# EasyEDA schematic SCH_Pedal ECU_2023-06-15.json
TITLE: Sheet_1; REV: 1.0; Date: 2023-06-01; Sheet: 1/1; Company: Your Company
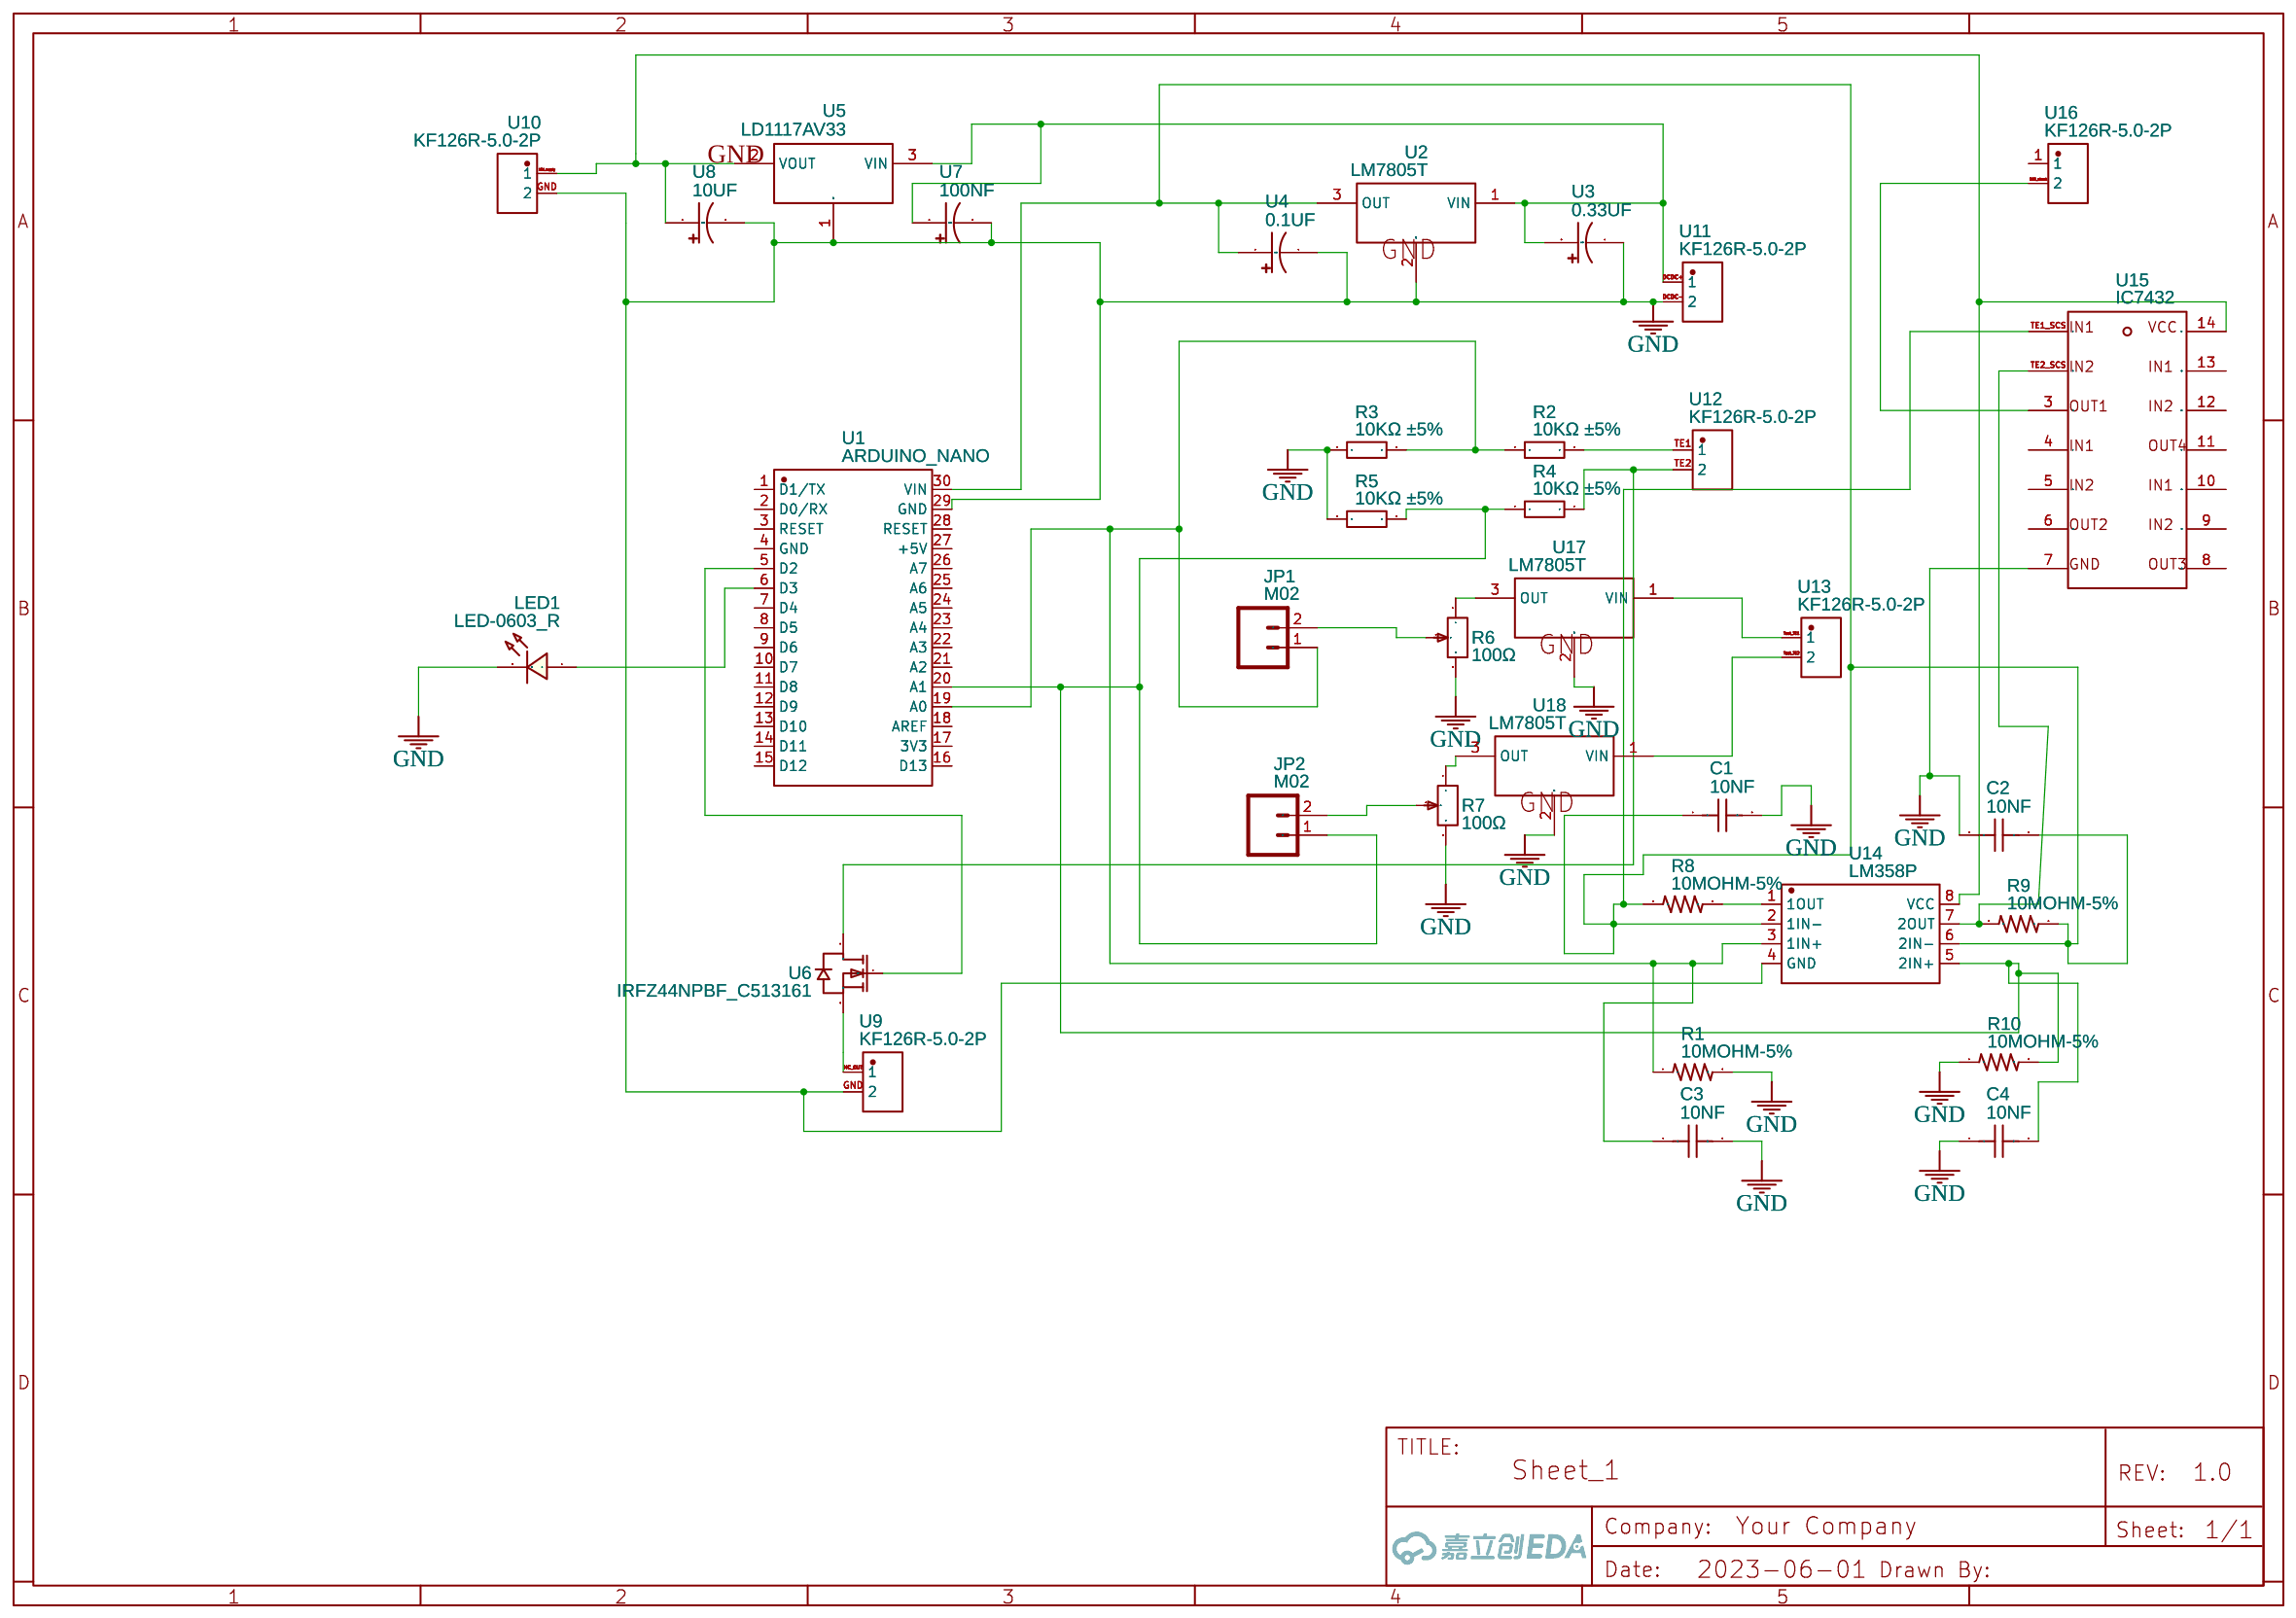
[diagram p0: schematic sheet]

## Parts
C1  10NF  [CAP-TH_L10.0-W4.5-P7.50-D0.6]
C2  10NF  [CAP-TH_L10.0-W4.5-P7.50-D0.6]
C3  10NF  [CAP-TH_L10.0-W4.5-P7.50-D0.6]
C4  10NF  [CAP-TH_L10.0-W4.5-P7.50-D0.6]
JP1  M02  [SCREWTERMINAL-3.5MM-2-NS]
JP2  M02  [SCREWTERMINAL-3.5MM-2-NS]
LED1  LED-0603_R  [LED0603_RED]
R1  10MOHM-5%  [0603]
R2  10KΩ ±5%  [RESISTANCE 10K]
R3  10KΩ ±5%  [RESISTANCE 10K]
R4  10KΩ ±5%  [RESISTANCE 10K]
R5  10KΩ ±5%  [RESISTANCE 10K]
R6  100Ω  [RES-ADJ-TH_3296W]
R7  100Ω  [RES-ADJ-TH_3296W]
R8  10MOHM-5%  [0603]
R9  10MOHM-5%  [0603]
R10  10MOHM-5%  [0603]
U1  ARDUINO_NANO  [COMM-TH_ARDUINO_NANO]
U2  LM7805T  [TO-220-3_L10.0-W4.5-P2.54-L]
U3  0.33UF  [CAP-SMD_L3.4-W2.9-RD]
U4  0.1UF  [CAP-SMD_L3.4-W2.9-RD]
U5  LD1117AV33  [TO-220-3_L10.0-W4.5-P2.54-L]
U6  IRFZ44NPBF_C513161  [TO-220-3_L10.0-W4.5-P2.54-L]
U7  100NF  [CAP-SMD_L3.4-W2.9-RD]
U8  10UF  [CAP-SMD_L3.4-W2.9-RD]
U9  KF126R-5.0-2P  [CONN-TH_P5.00_KF126R-5.0-2P]
U10  KF126R-5.0-2P  [CONN-TH_P5.00_KF126R-5.0-2P]
U11  KF126R-5.0-2P  [CONN-TH_P5.00_KF126R-5.0-2P]
U12  KF126R-5.0-2P  [CONN-TH_P5.00_KF126R-5.0-2P]
U13  KF126R-5.0-2P  [CONN-TH_P5.00_KF126R-5.0-2P]
U14  LM358P  [DIP-8_L9.4-W6.4-P2.54-LS9.1-BL]
U15  IC7432  [IC7432]
U16  KF126R-5.0-2P  [CONN-TH_P5.00_KF126R-5.0-2P]
U17  LM7805T  [TO-220-3_L10.0-W4.5-P2.54-L]
U18  LM7805T  [TO-220-3_L10.0-W4.5-P2.54-L]

## Library data of the parts
C1 C3 C4 = 250V 0.1UF 5% CBBCapacitor: Supplier: LCSC; Manufacturer: ReliaPro; Supplier Part: C46804; Package Display: No
C2 = 250V 0.1UF 5% CBBCapacitor: Supplier: LCSC; Manufacturer: ReliaPro; Supplier Part: C46804
JP1 JP2 = M02: Contributor: SparkFun
LED1 = LED-0603_R: Manufacturer: EVERLIGHT(台湾亿光); Manufacturer Part: 19-217/R6C-AL1M2VY/3T; Supplier Part: C72044; Supplier: LCSC; Contributor: LCEDA_01
R1 R8-R10 = 10MOHM-0603-1/10W-5%: Contributor: Turky Samy
R2-R5 = RESISTANCE_10K: Supplier: LCSC; Supplier Part: C123392; Manufacturer: Nanjing Shiheng Elec; Manufacturer Part: MF58 103J3470; Contributor: Evgeniy_ANP; JLCPCB Part Class: Extended Part
R6 R7 = 3296W-1-101LF: Supplier: LCSC; Manufacturer: BOURNS; Supplier Part: C83688; Resistance(Ohms): 100; Resistance (Ohms): 100; JLCPCB Part Class: Extended Part
U1 = ARDUINO_NANO: Supplier: LCSC; Supplier Part: C9900017879; Manufacturer: null; JLCPCB Part Class: Extended Part; Contributor: lcsc
U2 U17 U18 = LM7805T: Supplier: LCSC; Supplier Part: C507145; Manufacturer: HGC(华冠); Contributor: LCSC; JLCPCB Part Class: Extended Part
U3 = 0.33UF: Supplier: LCSC; Supplier Part: C9900002105; Manufacturer: null; Manufacturer Part: 0.33uF; JLCPCB Part Class: Extended Part; Contributor: LCSC
U4 U7 U8 = 0.33UF: Supplier: LCSC; Supplier Part: C9900002105; Manufacturer: null; Manufacturer Part: 0.33uF; JLCPCB Part Class: Extended Part; Contributor: LCSC; Package Display: No
U5 = LD1117AV33: Supplier: LCSC; Manufacturer: ST(意法半导体); Supplier Part: C32833; JLCPCB Part Class: Extended Part
U6 = IRFZ44NPBF_C513161: Supplier: LCSC; Supplier Part: C513161; Manufacturer: null; Manufacturer Part: IRFZ44NPBF; Contributor: LCSC
U9-U13 U16 = KF126R-5.0-2P: Supplier: LCSC; Supplier Part: C474902; Manufacturer: KEFA(科发); Contributor: LCSC; JLCPCB Part Class: Extended Part
U14 = LM358P: Supplier: LCSC; Manufacturer: TI(德州仪器); Supplier Part: C5213; JLCPCB Part Class: Extended Part
U15 = IC7432: Contributor: thana1759700

## Nets
GND: C1.2 C2.1 C3.2 C4.1 LED1.2 R1.2 R3.1 R5.1 R6.3 R7.3 R10.1 U1.29(GND) U2.2(GND) U3.1 U4.1 U5.1(GND) U7.1 U8.1 U9.GND(2) U10.GND(2) U11.DCDC-(2) U14.4(GND) U15.7 U17.2(GND) U18.2(GND)
Net-(C1-1): C1.1 C2.2 R8.1 R9.2 U1.30(VIN) U2.3(OUT) U4.2 U14.2(1IN-) U14.6(2IN-) U15.TE1_SCS(1)
Net-(C3-1): C3.1 JP1.1 R1.1 R2.1 R3.2 U1.19(A0) U14.3(1IN+)
Net-(C4-2): C4.2 JP2.1 R4.1 R5.2 R10.2 U1.20(A1) U14.5(2IN+)
Net-(JP1-2): JP1.2 R6.2
Net-(JP2-2): JP2.2 R7.2
Net-(LED1-1): LED1.1 U1.6(D3)
Net-(R2-2): R2.2 U12.TE1(1)
Net-(R4-2): R4.2 U6.2(D) U12.TE2(2)
Net-(R6-1): R6.1 U17.3(OUT)
Net-(R7-1): R7.1 U18.3(OUT)
Net-(R8-2): R8.2 U14.1(1OUT)
Net-(R9-1): R9.1 U14.7(2OUT) U15.TE2_SCS(2)
Net-(U1-5): U1.5(D2) U6.1(G)
Net-(U2-1): U2.1(VIN) U3.2 U5.3(VIN) U7.2 U11.DCDC+(1)
Net-(U5-2): U5.2(VOUT) U8.2 U10.10V supply(1) U14.8(VCC) U15.14
Net-(U6-3): U6.3(S) U9.MC_OUT(1)
Net-(U13-Test TE1): U13.Test TE1(1) U17.1(VIN)
Net-(U13-Test TE2): U13.Test TE2(2) U18.1(VIN)
Net-(U15-3): U15.3 U16.SCS_check(2)

Not connected (* = marked no-connect by the designer): U1 1(D1/TX) 2(D0/RX) 3(RESET) 4(GND) 7(D4) 8(D5) 9(D6) 10(D7) 11(D8) 12(D9) 13(D10) 14(D11) 15(D12) 16(D13) 17(3V3) 18(AREF) 21(A2) 22(A3) 23(A4) 24(A5) 25(A6) 26(A7) 27(+5V) 28(RESET); U15 4 5 6 8 9 10 11 12 13; U16 1
